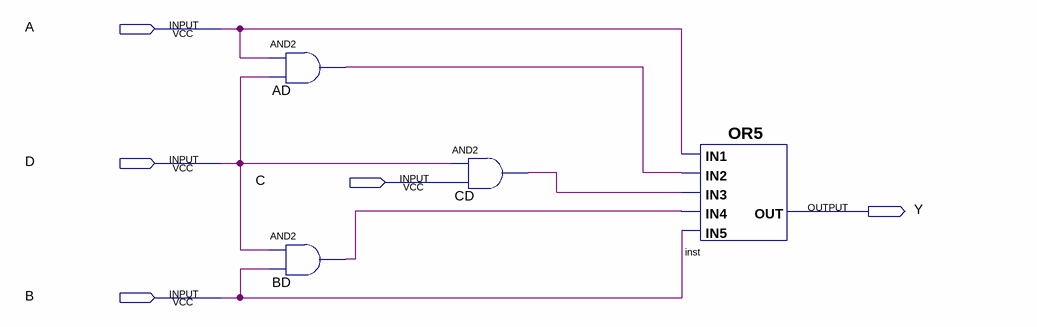
[diagram p0: schematic sheet]
// Quartus schematic pract1.bdf as structural Verilog: 4 symbols, 5 pins
module pract1 (
  input  A,
  input  D,
  input  C,
  input  B,
  output Y
);

  wire AD_out, BD_out, CD_out;

  and AD (AD_out, A, D);
  and BD (BD_out, D, B);
  and CD (CD_out, D, C);
  or inst (Y, A, AD_out, CD_out, BD_out, B);
endmodule
